# Altium schematic sheet 3EWL1-200001_02.SchDoc: Lantern PowerStage
size A4; Engineer: cronos; Revision: 6A1.0; SheetNumber: 2; SheetTotal: 5
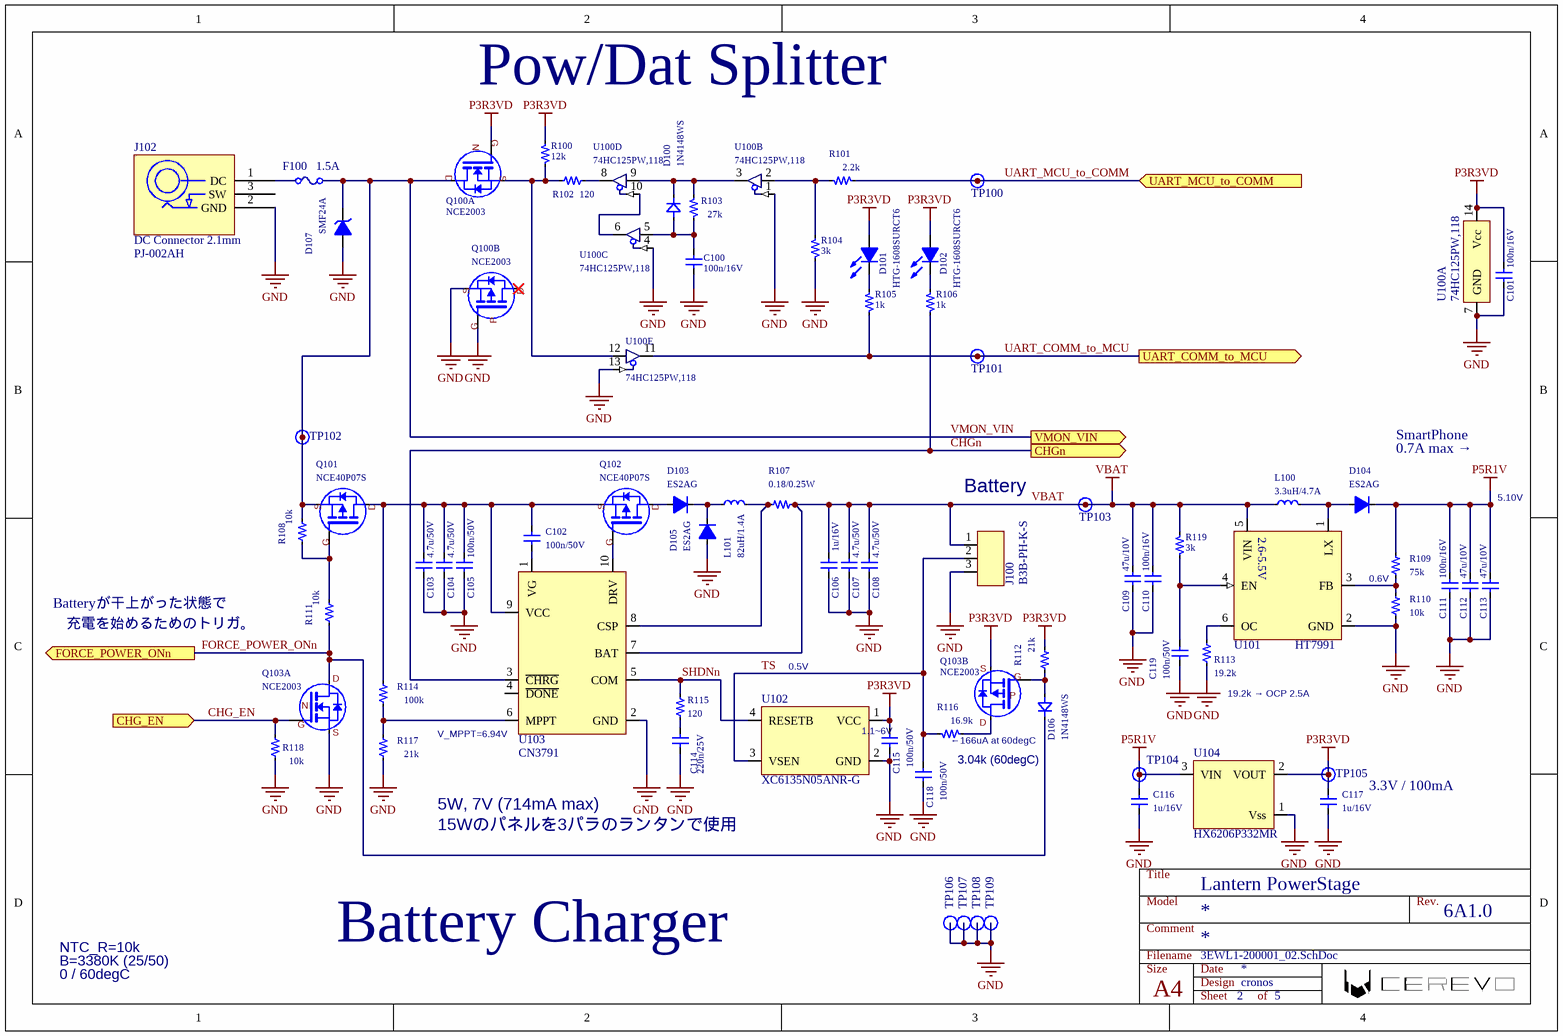
[diagram p0: 3EWL1-200001_02.SchDoc]

## Parts
C100  100n/16V  [SC2-1.00X0.50A]
C101  100n/16V  [SC2-1.00X0.50A]
C102  100n/50V  [SC2-1.00X0.50A]
C103  4.7u/50V  [SC2-3.20X1.60A]
C104  4.7u/50V  [SC2-3.20X1.60A]
C105  100n/50V  [SC2-1.00X0.50A]
C106  1u/16V  [SC2-1.00X0.50A]
C107  4.7u/50V  [SC2-3.20X1.60A]
C108  4.7u/50V  [SC2-3.20X1.60A]
C109  47u/10V  [SC2-3.20X2.50A]
C110  100n/16V  [SC2-1.00X0.50A]
C111  100n/16V  [SC2-1.00X0.50A]
C112  47u/10V  [SC2-3.20X2.50A]
C113  47u/10V  [SC2-3.20X2.50A]
C114  220n/25V  [SC2-1.00X0.50A]
C115  100n/50V  [SC2-1.00X0.50A]
C116  1u/16V  [SC2-1.00X0.50A]
C117  1u/16V  [SC2-1.00X0.50A]
C118  100n/50V  [SC2-1.00X0.50A]
C119  100n/50V  [SC2-1.00X0.50A]
D100  1N4148WS  [SD2-1.7X1.25A]
D101  HTG-1608SURCT6  [SOD-523F_CAPM3216X18N]
D102  HTG-1608SURCT6  [SOD-523F_CAPM3216X18N]
D103  ES2AG  [diodes_SMA]
D104  ES2AG  [diodes_SMA]
D105  ES2AG  [diodes_SMA]
D106  1N4148WS  [SD2-1.7X1.25A]
D107  SMF24A  [SOD-123]
F100  1.5A  [SR2-1.60X0.80A]
J100  B3B-PH-K-S  [B3B-PH-K-S]
J102  DC Connector 2.1mm  Manufacturer Part Number: PJ-002AH  [Connector_PJ-002AH]
L100  3.3uH/4.7A  [VLC6045]
L101  82uH/1.4A  [SCDS125T-820M-N]
Q100  NCE2003  [SOT23-6]  (parts A,B of 2)
Q101  NCE40P07S  [SOIC127P610X104_HS-9M]
Q102  NCE40P07S  [SOIC127P610X104_HS-9M]
Q103  NCE2003  [SOT23-6]  (parts A,B of 2)
R100  12k  [SR2-1.00X0.50A]
R101  2.2k  [SR2-1.00X0.50A]
R102  120  [SR2-1.00X0.50A]
R103  27k  [SR2-1.00X0.50A]
R104  3k  [SR2-1.00X0.50A]
R105  1k  [SR2-1.00X0.50A]
R106  1k  [SR2-1.00X0.50A]
R107  0.18/0.25W  [SR2-3.20X1.60A]
R108  10k  [SR2-1.00X0.50A]
R109  75k  [SR2-1.00X0.50A]
R110  10k  [SR2-1.00X0.50A]
R111  10k  [SR2-1.00X0.50A]
R112  21k  [SR2-1.00X0.50A]
R113  19.2k  [SR2-1.00X0.50A]
R114  100k  [SR2-1.00X0.50A]
R115  120  [SR2-1.00X0.50A]
R116  16.9k  [SR2-1.00X0.50A]
R117  21k  [SR2-1.00X0.50A]
R118  10k  [SR2-1.00X0.50A]
R119  3k  [SR2-1.00X0.50A]
TP100  TP  [1.0mmTH]  (value not drawn)
TP101  TP  [1.0mmTH]  (value not drawn)
TP102  TP  [1.0mmTH]  (value not drawn)
TP103  TP  [1.0mmTH]  (value not drawn)
TP104  TP  [1.0mmTH]  (value not drawn)
TP105  TP  [1.0mmTH]  (value not drawn)
TP106  TP  [1.0mmTH]  (value not drawn)
TP107  TP  [1.0mmTH]  (value not drawn)
TP108  TP  [1.0mmTH]  (value not drawn)
TP109  TP  [1.0mmTH]  (value not drawn)
U100  74HC125PW,118  [TSSOP14_e=0.65]  (parts A,B,C,D,E of 5)
U101  HT7991  [SOT23-6]
U102  XC6135N05ANR-G  [XC6135N05ANR-G]
U103  CN3791  [CN3791]
U104  HX6206P332MR  [SOT23-3]

## Ports
CHG_EN (in), CHGn (out), FORCE_POWER_ONn (out), UART_COMM_to_MCU (out), UART_MCU_to_COMM (in), VMON_VIN (out)

## Nets
GND: C100.2 C101.2 C103.1 C104.1 C105.2 C106.2 C107.1 C108.1 C109.1 C110.2 C111.2 C112.1 C113.1 C114.1 C115.2 C116.2 C117.2 C118.2 C119.2 D105.A D107.A J100.3 J102.2(GND) Q100.2(P_S) Q100.3(P_G) Q103.5(N_S) R104.2 R110.2 R113.2 R117.2 R118.2 TP106.1(TP1) TP107.1(TP1) TP108.1(TP1) TP109.1(TP1) U100.1(1OE) U100.4(2OE) U100.7(GND) U100.13(4OE) U101.2(GND) U102.2(GND) U103.2(GND) U104.1(Vss)
P3R3VD: C101.1 C115.1 C117.1 D101.A D102.A Q100.1(N_G) Q103.2(P_S) R100.1 R112.1 TP105.1(TP1) U100.14(Vcc) U102.1(VCC) U104.2(VOUT)
P5R1V: C111.1 C112.2 C113.2 C116.1 D104.C R109.1 TP104.1(TP1) U104.3(VIN)
VBAT: C106.1 C107.2 C108.2 C109.2 C110.1 J100.1 L100.1 R107.2 R119.1 TP103.1(TP1) U101.5(VIN) U103.7(BAT)
CHG_EN: Q103.1(N_G) R118.1 ; port CHG_EN
CHGn: R106.1 U103.3(~{CHRG}) ; port CHGn
FORCE_POWER_ONn: D106.K Q103.6(N_D) R111.2 ; port FORCE_POWER_ONn
SHDNn: R115.2 U102.4(RESETB) U103.5(COM)
TS: C118.1 J100.2 R116.2 U102.3(VSEN)
UART_COMM_to_MCU: R105.1 TP101.1(TP1) U100.11(4Y) ; port UART_COMM_to_MCU
UART_MCU_to_COMM: R101.1 TP100.1(TP1) ; port UART_MCU_to_COMM
VMON_VIN: D107.C F100.2 Q100.6(N_D) Q101.2(S) R108.1 TP102.1(TP1) ; port VMON_VIN
NetC100_1: C100.1 D100.A R103.2 U100.5(2A)
NetC102_1: C102.1 C103.2 C104.2 C105.1 Q101.3(D) Q102.2(S) R114.1 U103.9(VCC)
NetC102_2: C102.2 U103.1(VG)
NetC114_2: C114.2 R115.1
NetC119_1: C119.1 R119.2 U101.4(EN)
NetD100_K: D100.K R103.1 U100.3(1Y) U100.9(3A)
NetD101_C: D101.C R105.2
NetD102_C: D102.C R106.2
NetD103_A: D103.A Q102.3(D)
NetD103_C: D103.C D105.C L101.1
NetD104_A: D104.A L100.2 U101.1(LX)
NetD106_A: D106.A Q103.3(P_G) R112.2
NetF100_1: F100.1 J102.1(DC)
NetL101_2: L101.2 R107.1 U103.8(CSP)
NetQ100_5: Q100.5(N_S) R100.2 R102.2 U100.12(4A)
NetQ101_1: Q101.1(G) R108.2 R111.1
NetQ102_1: Q102.1(G) U103.10(DRV)
NetQ103_4: Q103.4(P_D) R116.1
NetR101_2: R101.2 R104.1 U100.2(1A)
NetR102_1: R102.1 U100.8(3Y)
NetR109_2: R109.2 R110.1 U101.3(FB)
NetR113_1: R113.1 U101.6(OC)
NetR114_2: R114.2 R117.1 U103.6(MPPT)
NetU100_6: U100.6(2Y) U100.10(3OE)

Not connected (* = marked no-connect by the designer): J102 3(SW); Q100 4(P_D)*; U103 4(~{DONE})

## Notes on the sheet
- Pow/Dat Splitter
- SmartPhone
- Battery
- 0.7A max →
- 5.10V
- 0.6V
- Batteryが干上がった状態で
- 充電を始めるためのトリガ。
- (near U102) 0.5V
- (near R113) 19.2k → OCP 2.5A
- (near U103) V_MPPT=6.94V
- (near R116) ←166uA at 60degC
- 3.04k (60degC)
- 3.3V / 100mA
- 5W, 7V (714mA max)
- 15Wのパネルを3パラのランタンで使用
- 0 / 60degC
- B=3380K (25/50)
- NTC_R=10k
- Battery Charger
- Model
- Title
- Rev.
- Size
- Filename
- Comment
- Date
- Design
- A4
- Sheet          of
- (in symbol HT7991) 2.6-5.5V
- (in symbol NCE2003, part A) D; N; G; S
- (in symbol NCE2003, part B) S; G; P; D
- (in symbol XC6135N05ANR-G) 1.1~6V

## Library data of the parts
C100 C101 C110 C111 = C: 100n, 16V, X7R, 1005Size; Manufacturer: TDK; Manufacturer Part Number: C1005X5R1C104KT000N; Description 1: Capacitor (non-polar); Commodity: MLCC; Replace: OK; FirstPublished: 2012/10/14; LatestRevisionDate: *; LatestRevisionNote: *; Mounting: *; Description 2: *; Footprint(imperial): 0402; Footprint(metric): 1005; Value: 100n/16V
C102 C105 C115 C118 C119 = C: 100n, 50V, X7R, 1005Size; Manufacturer: Walsin; Manufacturer Part Number: 0402B104K500CT; Description 1: Capacitor (non-polar); Commodity: MLCC; Replace: OK; FirstPublished: 2012/10/14; LatestRevisionDate: *; LatestRevisionNote: *; Mounting: *; Description 2: *; Footprint(imperial): 0402; Footprint(metric): 1005; Value: 100n/50V
C103 C104 C107 C108 = C: 4.7u/50V, X7R, 3216Size; Manufacturer: Murata; Manufacturer Part Number: GRM31CR71H475KA12L; Commodity: MLCC; Replace: OK; Mounting: *; Footprint(imperial): 1206; Footprint(metric): 3216; Value: 4.7u/50V
C106 C116 C117 = C: 1u, 16V, X7R, 1005Size; Manufacturer: Yageo; Manufacturer Part Number: CC0805KKX7R7BB105; Description 1: Capacitor (non-polar); Commodity: MLCC; Replace: OK; FirstPublished: 2012/10/14; LatestRevisionDate: *; LatestRevisionNote: *; Mounting: *; Description 2: *; Footprint(imperial): 0402; Footprint(metric): 1005; Value: 1u/16V
C109 C112 C113 = C: 47u/10V, X7R, 3225Size; Manufacturer: Murata; Manufacturer Part Number: GRM32ER71A476KE15L; Commodity: MLCC; Replace: OK; Mounting: *; Footprint(imperial): 1210; Footprint(metric): 3225; Value: 47u/10V
C114 = C: 220n, 25V, X7R, 1005Size; Manufacturer: Walsin; Manufacturer Part Number: 0402B224K250CT; Description 1: Capacitor (non-polar); Commodity: MLCC; Replace: OK; FirstPublished: 2012/10/14; LatestRevisionDate: *; LatestRevisionNote: *; Mounting: *; Description 2: *; Footprint(imperial): 0402; Footprint(metric): 1005; Value: 220n/25V
D100 D106 = 1N4148WS: Diode Signal 75V 150mA 1712; Manufacturer: Fairchild Semiconductor; Description 2: 75V 150MA SOD323F; Commodity: Diode Small Dignal; Replace: OK; Manufacturer Part Number: 1N4148WS; Mounting: *; Value: 1N4148WS
D101 D102 = Diode_LED: Manufacturer: HTGLight; Commodity: LED; Replace: OK; Value: HTG-1608SURCT6; Manufacturer Part Number: HTG-1608SURCT6; Footprint(imperial): 0603; Footprint(metric): 1608
D103-D105 = Diode_switching: 50V, 2A, Vf_2A=1V, 35nSec, SMA; Manufacturer: Shikues; Commodity: Diode; Replace: OK; Manufacturer Part Number: ES2AG; Mounting: *; Value: ES2AG
D107 = Diode_Zenner: Manufacturer: DOWO; Commodity: TVS; Replace: OK; Manufacturer Part Number: SMF24A; Mounting: *; Value: SMF24A
F100 = Fuse: 1.5A, 32V, 1608Size; Manufacturer: Shenzhen lanson Elec; Manufacturer Part Number: 06H1150D; Replace: NG; Commodity: Fuse; Value: 1.5A; Footprint(imperial): 0603; Footprint(metric): 1608
J100 = Con3: PH 3pin 2mm pitch; Manufacturer: JST; Replace: NG; Commodity: Connector; Manufacturer Part Number: B3B-PH-K-S; Mounting: *; Value: B3B-PH-K-S
J102 = Connector - DC_PJ-002AH: Connector - DC 12V; Manufacturer: CUI Inc.; Replace: NG; Mounting: *; Commodity: Connector; Value: PJ-002AH
L100 = L: 3.3uH, 4.7A, 6x6x4.5mm; Manufacturer: TDK; Manufacturer Part Number: VLC6045T-3R3N; Commodity: Inductor; Replace: OK; PackageReference: *; Mounting: *; Footprint (imperial): 6 x 6 x 4.5mm; Value: 3.3uH/4.7A
L101 = L: 82uH, 1.4A, 12.5x12.5x6mm; Manufacturer: Chilisin Elec; Commodity: Inductor; Replace: OK; PackageReference: *; Manufacturer Part Number: SCDS125T-820M-N; Mounting: *; Footprint (imperial): 12.5 x 12.5 x 6.0mm; Value: 82uH/1.4A
Q100 Q103 = NCE2003: N(20V, 55mohm, Vgs(th)=1.2V ), P(-20V, 100mohm, Vgs(th)=-1V), SOT23-6; Manufacturer: ncepower; Commodity: MOSFET; Replace: OK; Mounting: *; Manufacturer Part Number: NCE2003; Value: NCE2003
Q101 Q102 = Pch_MOSFET: -40V, -6.2A, 30mohm; pin to pad: 1>2 2>1; Manufacturer: Wuxi NCE Power Semiconductor; Commodity: MOSFET; Replace: OK; Manufacturer Part Number: NCE40P07S; Mounting: *; Value: NCE40P07S
R100 = R: 12k, 1%, 1005Size; Manufacturer: YAGEO; Manufacturer Part Number: RC0402FR-0712KL; Description 1: Resistor; Replace: OK; FirstPublished: 2012/10/14; LatestRevisionDate: *; LatestRevisionNote: *; PackageReference: *; Mounting: *; Description 2: *; Value: 12k; Commodity: Resistor; Footprint(imperial): 0402; Footprint(metric): 1005
R101 = R: 2.2k, 1%, 1005Size; Manufacturer: YAGEO; Manufacturer Part Number: RC0402FR-072K2RL; Description 1: Resistor; Replace: OK; FirstPublished: 2012/10/14; LatestRevisionDate: *; LatestRevisionNote: *; PackageReference: *; Mounting: *; Description 2: *; Value: 2.2k; Commodity: Resistor; Footprint(imperial): 0402; Footprint(metric): 1005
R102 R115 = R: 120, 1%, 1005Size; Manufacturer: YAGEO; Manufacturer Part Number: RC0402FR-07120RL; Description 1: Resistor; Replace: OK; FirstPublished: 2012/10/14; LatestRevisionDate: *; LatestRevisionNote: *; PackageReference: *; Mounting: *; Description 2: *; Value: 120; Commodity: Resistor; Footprint(imperial): 0402; Footprint(metric): 1005
R103 = R: 27k, 1%, 1005Size; Manufacturer: YAGEO; Manufacturer Part Number: RC0402FR-0727KL; Description 1: Resistor; Replace: OK; FirstPublished: 2012/10/14; LatestRevisionDate: *; LatestRevisionNote: *; PackageReference: *; Mounting: *; Description 2: *; Value: 27k; Commodity: Resistor; Footprint(imperial): 0402; Footprint(metric): 1005
R104 R119 = R: 3k, 1%, 1005Size; Manufacturer: YAGEO; Manufacturer Part Number: RC0402FR-073KL; Description 1: Resistor; Replace: OK; FirstPublished: 2012/10/14; LatestRevisionDate: *; LatestRevisionNote: *; PackageReference: *; Mounting: *; Description 2: *; Value: 3k; Commodity: Resistor; Footprint(imperial): 0402; Footprint(metric): 1005
R105 R106 = R: Rsisiter 2pin; Manufacturer: Yageo; Manufacturer Part Number: RC0402FR-071KL; Description 1: Resistor; Replace: OK; FirstPublished: 2012/10/14; LatestRevisionDate: *; LatestRevisionNote: *; Mounting: *; Description 2: *; Commodity: Resistor; Footprint(imperial): 0402; Footprint(metric): 1005; Value: 1k
R107 = R: 0.18, 0.25W, 1%, 800ppm; Manufacturer: UNI-ROYAL; Manufacturer Part Number: 1206W4F180LT5E; Commodity: Resistor; Replace: OK; Mounting: *; Footprint(imperial): 1206; Footprint(metric): 3216; Value: 0.18/0.25W
R108 R110 R111 R118 = R: Manufacturer: YAGEO; Manufacturer Part Number: RC0402FR-0710KL; Description 1: Resistor; Replace: OK; FirstPublished: 2012/10/14; LatestRevisionDate: *; LatestRevisionNote: *; PackageReference: *; Mounting: *; Description 2: *; Value: 10k; Commodity: Resistor; Footprint(imperial): 0402; Footprint(metric): 1005
R109 = R: Manufacturer: YAGEO; Manufacturer Part Number: RC0402FR-0775KL; Description 1: Resistor; Replace: OK; FirstPublished: 2012/10/14; LatestRevisionDate: *; LatestRevisionNote: *; PackageReference: *; Mounting: *; Description 2: *; Value: 75k; Commodity: Resistor; Footprint(imperial): 0402; Footprint(metric): 1005
R112 R117 = R: 21k, 1%, 1005Size; Manufacturer: YAGEO; Manufacturer Part Number: RC0402FR-0721KL; Description 1: Resistor; Replace: OK; FirstPublished: 2012/10/14; LatestRevisionDate: *; LatestRevisionNote: *; PackageReference: *; Mounting: *; Description 2: *; Value: 21k; Commodity: Resistor; Footprint(imperial): 0402; Footprint(metric): 1005
R113 = R: Manufacturer: YAGEO; Manufacturer Part Number: RC0402FR-0719K2L; Description 1: Resistor; Replace: OK; FirstPublished: 2012/10/14; LatestRevisionDate: *; LatestRevisionNote: *; PackageReference: *; Mounting: *; Description 2: *; Value: 19.2k; Commodity: Resistor; Footprint(imperial): 0402; Footprint(metric): 1005
R114 = R: 100k, 1%, 1005Size; Manufacturer: YAGEO; Manufacturer Part Number: RC0402FR-07100KL; Description 1: Resistor; Replace: OK; FirstPublished: 2012/10/14; LatestRevisionDate: *; LatestRevisionNote: *; PackageReference: *; Mounting: *; Description 2: *; Value: 100k; Commodity: Resistor; Footprint(imperial): 0402; Footprint(metric): 1005
R116 = R: 16.9k, 1%, 1005Size; Manufacturer: YAGEO; Manufacturer Part Number: RC0402FR-0716K9L; Description 1: Resistor; Replace: OK; FirstPublished: 2012/10/14; LatestRevisionDate: *; LatestRevisionNote: *; PackageReference: *; Mounting: *; Description 2: *; Value: 16.9k; Commodity: Resistor; Footprint(imperial): 0402; Footprint(metric): 1005
TP100-TP109 = TP: Mounting: NM
U100 = 74HC125: 3-State Quad Buffer; Manufacturer: NXP; Commodity: Logic; Replace: OK; Manufacturer Part Number: 74HC125PW,118; Mounting: *; Value: 74HC125PW,118
U101 = HT7991: boost, 2.6-5.5V, 2.5A, 1MHz; Manufacturer: Holtek; Commodity: SMPS; Replace: OK; Manufacturer Part Number: HT7991; Mounting: *; Value: HT7991
U102 = XC6135N05ANR-G: Voltage Detector Vth=0.5V; Manufacturer: TOREX; Replace: OK; Commodity: Voltage Detector; Manufacturer Part Number: XC6135N05ANR-G; Mounting: *; Value: XC6135N05ANR-G
U103 = CN3791: 8:1 Multiplexer; Manufacturer: CONSONANCE; Commodity: Li Charger; Replace: OK; Manufacturer Part Number: CN3791; Mounting: *; Value: CN3791
U104 = HX6206P332MR: 3.3V 100mA SOT-23; Manufacturer: hengjiaxing; Commodity: Linear Voltage Reg; Replace: NG; Manufacturer Part Number: HX6206P332MR; Value: HX6206P332MR